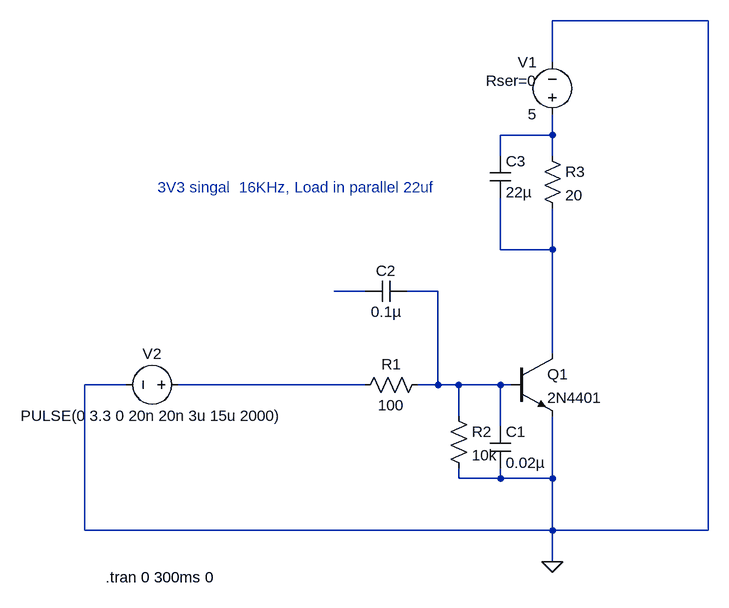
[diagram p0: schematic Draft1.asc]
Draft1.asc, the LTspice schematic file:
Version 4
SHEET 1 880 680
WIRE 384 -544 144 -544
WIRE 144 -480 144 -544
WIRE 144 -368 144 -400
WIRE 144 -368 64 -368
WIRE 64 -336 64 -368
WIRE 144 -336 144 -368
WIRE 64 -192 64 -272
WIRE 144 -192 144 -256
WIRE 144 -192 64 -192
WIRE -144 -128 -192 -128
WIRE -32 -128 -80 -128
WIRE 144 -32 144 -192
WIRE -512 16 -576 16
WIRE -144 16 -432 16
WIRE -32 16 -32 -128
WIRE -32 16 -64 16
WIRE 0 16 -32 16
WIRE 64 16 0 16
WIRE 80 16 64 16
WIRE 0 64 0 16
WIRE 64 80 64 16
WIRE 0 160 0 144
WIRE 64 160 64 144
WIRE 64 160 0 160
WIRE 144 160 144 64
WIRE 144 160 64 160
WIRE -576 240 -576 16
WIRE 144 240 144 160
WIRE 144 240 -576 240
WIRE 384 240 384 -544
WIRE 384 240 144 240
WIRE 144 288 144 240
FLAG 144 288 0
DATAFLAG 144 -128 ""
SYMBOL npn 80 -32 R0
SYMATTR InstName Q1
SYMATTR Value 2N4401
SYMBOL voltage 144 -384 R180
WINDOW 0 24 96 Left 2
WINDOW 3 24 16 Left 2
WINDOW 123 0 0 Left 0
WINDOW 39 24 68 Left 2
SYMATTR InstName V1
SYMATTR Value 5
SYMATTR SpiceLine Rser=0
SYMBOL res 128 -352 R0
SYMATTR InstName R3
SYMATTR Value 20
SYMATTR SpiceLine tol=1 pwr=2
SYMBOL res -48 0 R90
WINDOW 0 0 56 VBottom 2
WINDOW 3 32 56 VTop 2
SYMATTR InstName R1
SYMATTR Value 100
SYMATTR SpiceLine tol=1 pwr=1
SYMBOL voltage -416 16 R90
WINDOW 0 -32 56 VBottom 2
WINDOW 3 32 56 VTop 2
WINDOW 123 0 0 Left 0
WINDOW 39 0 0 Left 0
SYMATTR InstName V2
SYMATTR Value PULSE(0 3.3 0 20n 20n 3u 15u 2000)
SYMBOL cap 48 80 R0
SYMATTR InstName C1
SYMATTR Value 0.02µ
SYMATTR SpiceLine V=25 Irms=0 Rser=0 Lser=0
SYMBOL cap -144 -112 R270
WINDOW 0 32 32 VTop 2
WINDOW 3 0 32 VBottom 2
SYMATTR InstName C2
SYMATTR Value 0.1µ
SYMATTR SpiceLine V=10 Irms=3.41 Rser=0.0133158 Lser=0
SYMBOL res -16 48 R0
SYMATTR InstName R2
SYMATTR Value 10k
SYMATTR SpiceLine tol=1 pwr=0.1
SYMBOL cap 48 -336 R0
SYMATTR InstName C3
SYMATTR Value 22µ
SYMATTR SpiceLine V=10 Irms=0 Rser=0 Lser=0
TEXT -544 312 Left 2 !.tran 0 300ms 0
TEXT -464 -288 Left 2 ;3V3 singal  16KHz, Load in parallel 22uf

The netlist it stands for:
* Draft1.asc
Q1 N002 N004 0 0 2N4401
V1 N001 0 5 Rser=0
R3 N001 N002 20 tol=1 pwr=2
R1 N004 N005 100 tol=1 pwr=1
V2 N005 0 PULSE(0 3.3 0 20n 20n 3u 15u 2000)
C1 N004 0 0.02µ V=25 Irms=0 Rser=0 Lser=0
C2 N003 N004 0.1µ V=10 Irms=3.41 Rser=0.0133158 Lser=0
R2 N004 0 10k tol=1 pwr=0.1
C3 N001 N002 22µ V=10 Irms=0 Rser=0 Lser=0
.model NPN NPN
.model PNP PNP
.lib standard.bjt
.tran 0 300ms 0
* 3V3 singal  16KHz, Load in parallel 22uf
.backanno
.end